# EAGLE design Board (EAGLE 8.5.2)
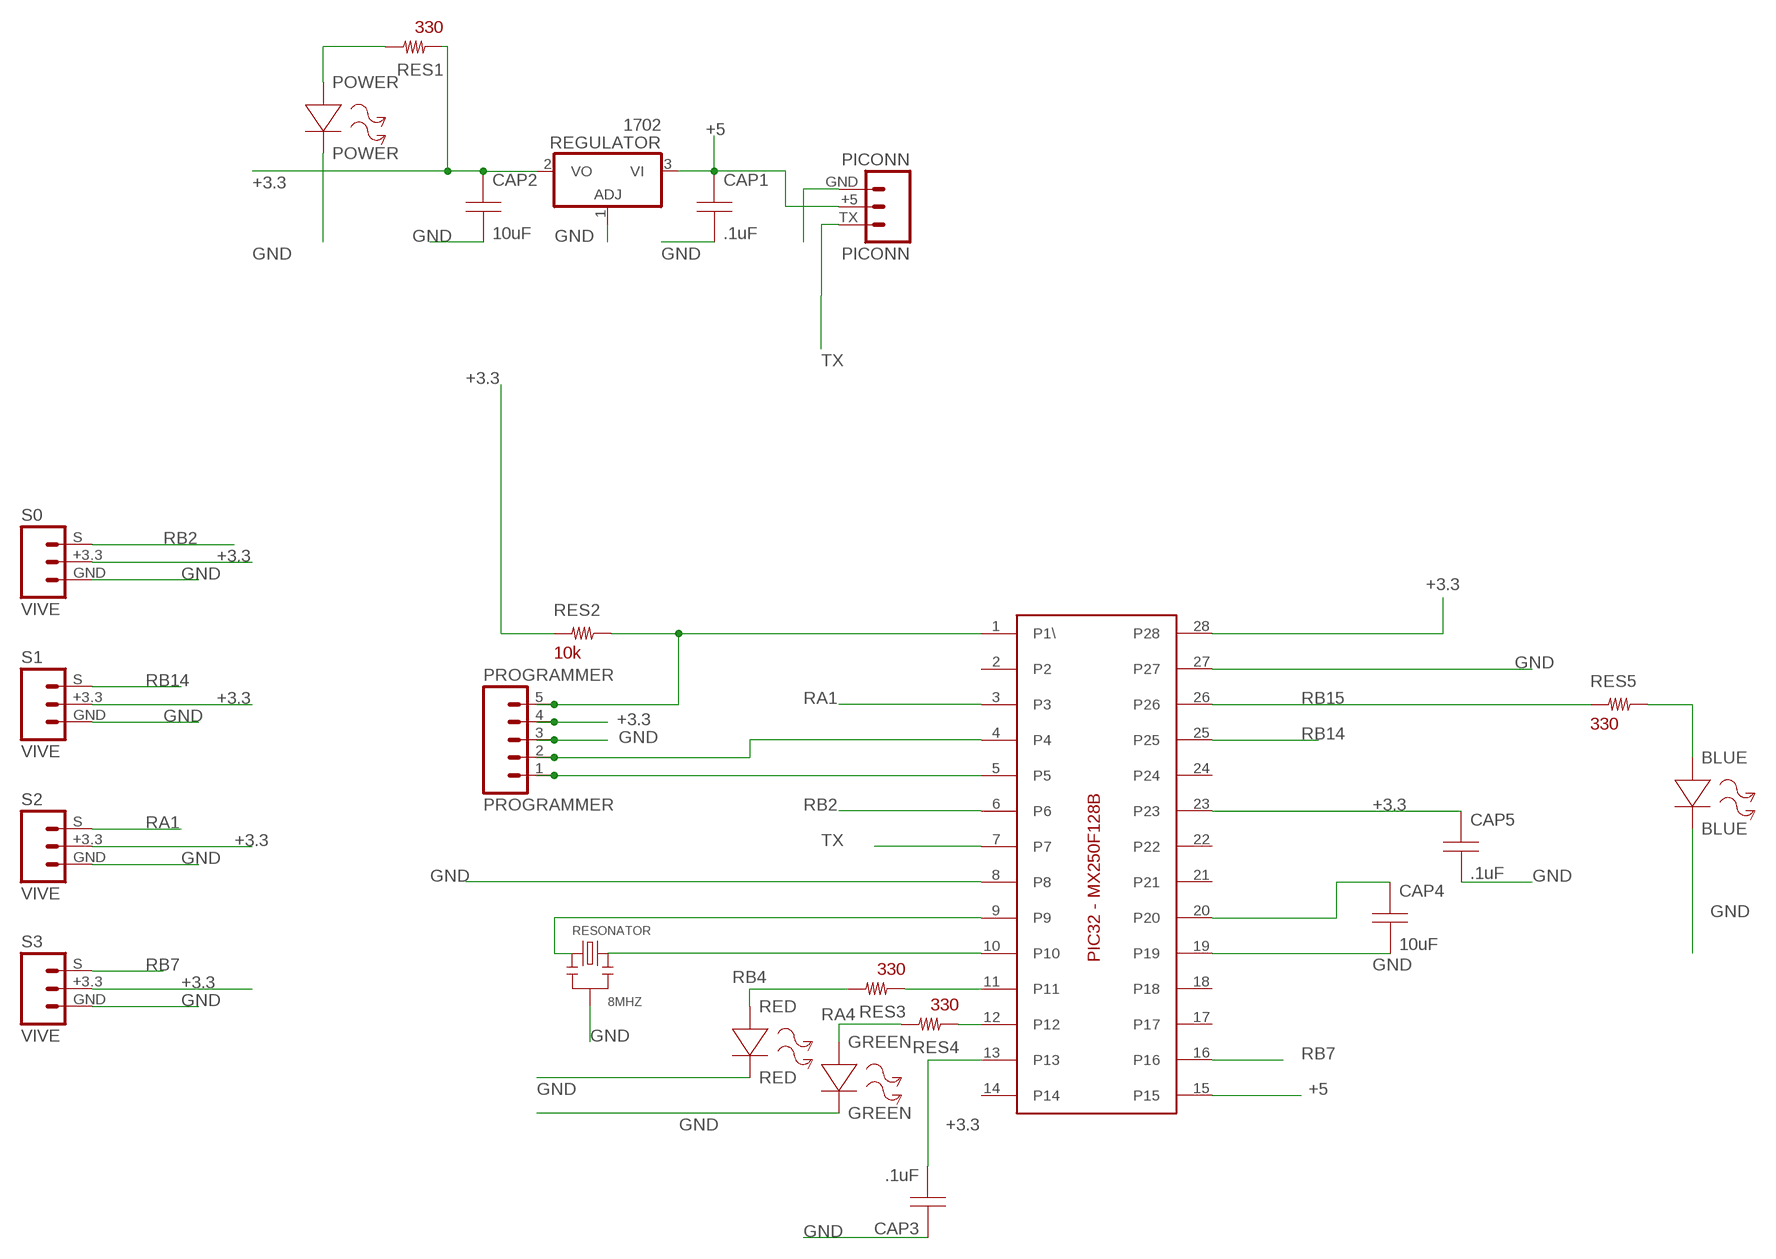
[diagram p0: schematic, sheet 1]

## Parts
1702  REGULATOR  [REGULATOR3P]
BLUE  BLUE  LEDL0603  [L0603]
CAP1  .1uF  CAPACITOR0603  [C0603]
CAP2  10uF  CAPACITOR0805  [C0805]
CAP3  .1uF  CAPACITOR0603  [C0603]
CAP4  10uF  CAPACITOR0805  [C0805]
CAP5  .1uF  CAPACITOR0603  [C0603]
GREEN  GREEN  LEDL0603  [L0603]
PIC  PIC32-MX250F128BSSOP  [PIC32SSOP]
PICONN  PICONN  [PICONN]
POWER  POWER  LEDL0603  [L0603]
PROGRAMMER  PROGRAMMER  PROGRAMMERPTH  [PROGRAMMER5P]
RED  RED  LEDL0603  [L0603]
RES1  330  RESISTORR0603  [R0603]
RES2  10k  RESISTORR0603  [R0603]
RES3  330  RESISTORR0603  [R0603]
RES4  330  RESISTORR0603  [R0603]
RES5  330  RESISTORR0603  [R0603]
RESONATOR  8MHZ  OSCILATOROSC  [OSC]
S0  VIVE  [VIVE]
S1  VIVE  [VIVE]
S2  VIVE  [VIVE]
S3  VIVE  [VIVE]

## Nets
+3.3: 1702.2(VO) CAP2.1(A) CAP3.2(B) CAP5.1(A) PIC.13 PIC.23 PIC.28 PROGRAMMER.4 RES1.1 RES2.1 S0.+3.3 S1.+3.3 S2.+3.3 S3.+3.3
+5: 1702.3(VI) CAP1.1(A) PIC.15 PICONN.+5
GND: 1702.1(ADJ) BLUE.2(-) CAP1.2(B) CAP2.2(B) CAP3.1(A) CAP4.2(B) CAP5.2(B) GREEN.2(-) PIC.8 PIC.19 PIC.27 PICONN.GND POWER.2(-) PROGRAMMER.3 RED.2(-) RESONATOR.2 S0.GND S1.GND S2.GND S3.GND
N$1: PIC.10 RESONATOR.3
N$2: PIC.9 RESONATOR.1
N$3: POWER.1(+) RES1.2
N$4: PIC.4 PROGRAMMER.2
N$5: CAP4.1(A) PIC.20
N$6: PIC.12 RES4.1
N$7: PIC.1(P1\) PROGRAMMER.5 RES2.2
N$8: PIC.11 RES3.1
N$9: PIC.5 PROGRAMMER.1
N$11: BLUE.1(+) RES5.2
RA1: PIC.3 S2.S
RA4: GREEN.1(+) RES4.2
RB2: PIC.6 S0.S
RB4: RED.1(+) RES3.2
RB7: PIC.16 S3.S
RB14: PIC.25 S1.S
RB15: PIC.26 RES5.1
TX: PIC.7 PICONN.TX
Unconnected: PIC.2 PIC.14 PIC.17 PIC.18 PIC.21 PIC.22 PIC.24

## Library data of the parts
1702 = 433:REGULATOR: Positive VOLTAGE REGULATOR
BLUE GREEN POWER RED = 433:LED
CAP1-CAP5 = 433:CAPACITOR
PIC = 433:PIC32-MX250F128B
PICONN = 433:PICONN
PROGRAMMER = 433:PROGRAMMER: Header 5 Standard 5-pin 0.1" header. Use with straight break away headers (SKU : PRT-00116), right angle break away headers (PRT-00553), swiss pins (PRT-00743), machine pins (PRT-00117), and female headers (PRT-00115). Molex polarized connector foot print use with SKU : PRT-08230 with associated crimp pins and housings.
RES1-RES5 = 433:RESISTOR
RESONATOR = 433:OSCILATOR: 306030010
S0 S1-S3 = 433:VIVE

## Board
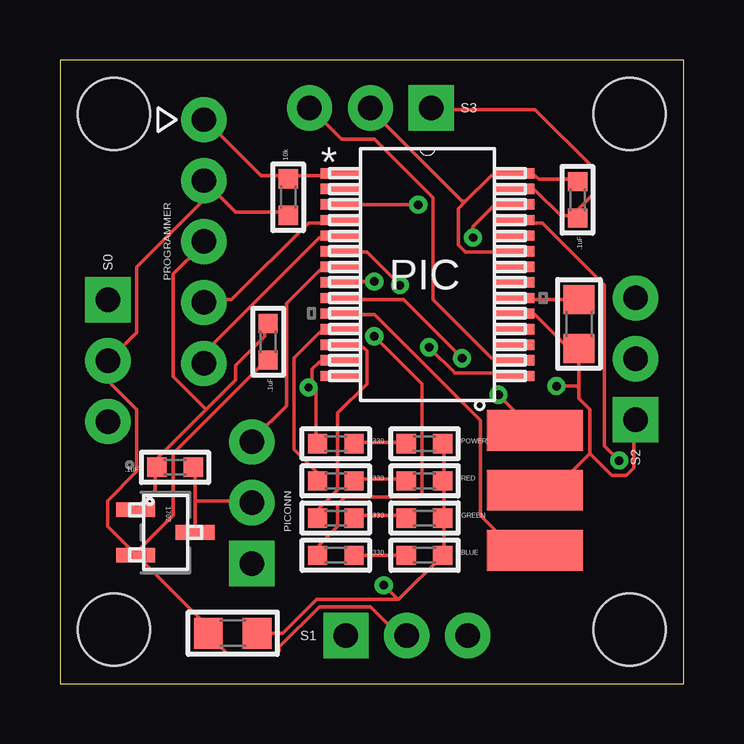
[diagram p1: board, top side]
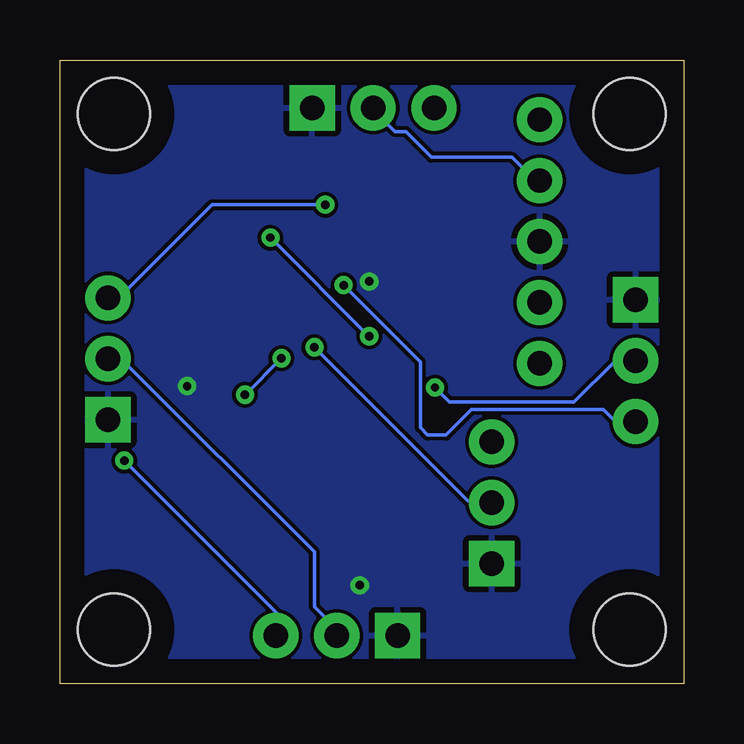
[diagram p2: board, bottom side, seen from below]

Size 26 x 26 mm. Coordinates in mm from the lower left corner, seen from the top.
Outline: 0,0 26,0 26,26 0,26 0,0
Copper layers (1*16): Top 0.035mm / dielectric 1.5mm / Bottom 0.035mm
Design rules "default": minimum track width 6mil, minimum drill 0.35mm, track to track 6mil, track to pad 6mil, pad to pad 6mil, via to via 6mil, smd to smd 6mil, copper to edge 40mil, drill to drill 6mil, minimum pad ring 10mil, minimum via ring 8mil, stop-mask expansion 4mil, vias tented up to drill 0mil, thermal gap 10mil
Holes 3 mm at 2.25,23.75 23.75,23.75 23.75,2.25 2.25,2.25

### Footprints (pad centres in the part's own frame; a part is rotated, then mirrored left to right if it is on the bottom)
REGULATOR3P = smd 0.61 x 1.626: 1 -0.95,-1.245; 2 0.95,-1.245; 3 0,1.245
L0603 = smd 0.8 x 0.8: 1 -0.762,0; 2 0.762,0
C0603 = smd 0.8 x 0.8: 1 -0.762,0; 2 0.762,0
C0805 = smd 1.2 x 1.3: 1 -1.016,0; 2 1.016,0
PIC32SSOP = smd 1.676 x 0.432: 1 -3.617,4.225; 2 -3.617,3.575; 3 -3.617,2.925; 4 -3.617,2.275; 5 -3.617,1.625; 6 -3.617,0.975; 7 -3.617,0.325; 8 -3.617,-0.325; 9 -3.617,-0.975; 10 -3.617,-1.625; 11 -3.617,-2.275; 12 -3.617,-2.925; 13 -3.617,-3.575; 14 -3.617,-4.225; 15 3.617,-4.225; 16 3.617,-3.575; 17 3.617,-2.925; 18 3.617,-2.275; 19 3.617,-1.625; 20 3.617,-0.975; 21 3.617,-0.325; 22 3.617,0.325; 23 3.617,0.975; 24 3.617,1.625; 25 3.617,2.275; 26 3.617,2.925; 27 3.617,3.575; 28 3.617,4.225
PICONN = drill 1.016 pad 1.88: +5 2.54,0; TX 5.08,0 | drill 1.016 pad 1.88 square: GND 0,0
PROGRAMMER5P = drill 1.016 pad 1.88: 1 0,0; 2 2.54,0; 3 5.08,0; 4 7.62,0; 5 10.16,0
R0603 = smd 0.8 x 0.8: 1 -0.762,0; 2 0.762,0
OSC = smd 1.7 x 4: 1 -2.497,-0.499; 2 -0.012,-0.501; 3 2.499,-0.508
VIVE = drill 1.016 pad 1.88: +3.3 2.54,0; S 5.08,0 | drill 1.016 pad 1.88 square: GND 0,0

### Placement (x,y rotation side)
1702  4.4,6.3 270 top
BLUE  15.2,5.35 0 top
CAP1  4.8,9.02 180 top
CAP2  7.2,2.1 0 top
CAP3  8.68,14.25 270 top
CAP4  21.64,14.99 270 top
CAP5  21.58,20.17 270 top
GREEN  15.2,6.9 0 top
PIC  15.32,17.05 0 top
PICONN  8,5 90 top
POWER  15.2,10 0 top
PROGRAMMER  6,13.35 90 top
RED  15.2,8.45 0 top
RES1  11.5,10 0 top
RES2  9.52,20.28 90 top
RES3  11.5,8.45 0 top
RES4  11.5,6.9 0 top
RES5  11.5,5.35 0 top
RESONATOR  20.3,8.05 270 top
S0  2,16 270 top
S1  11.92,2 0 top
S2  24,11 90 top
S3  15.48,24 180 top

### Tracks (layer width: path | path; a pad name or v marks a point on that pad's centre or on a via)
+3.3  (via drill 0.35)
  Top 0.152: CAP5.1 21.49,21.03 19.96,21.03 19.81,21.18 19.05,21.18 PIC.28 18.9,21.18 17.98,21.18 16.92,20.12 | 16.92,20.12 16.61,19.81 16.61,18.29 16.92,17.98 18.9,17.98 PIC.23 | 16.92,20.12 16.76,20.12 12.95,23.93 S3.+3.3 | 6.4,20.57 6.1,20.88 PROGRAMMER.4 6.4,20.57 | 6.4,20.57 7.32,19.66 9.45,19.66 RES2.1 | 10.52,12.5 10.67,12.34 10.67,10.06 RES1.1 | 10.52,12.5 10.52,13.11 10.82,13.41 11.58,13.41 PIC.13 | v10.36,12.34 10.52,12.5 | 6.4,20.57 3.2,17.37 3.2,14.63 2.13,13.56 S0.+3.3 2.13,13.41 2.13,12.5 3.2,11.43 3.2,8.84 1.98,7.62 1.98,6.55 3.05,5.49 1702.2 | CAP3.2 8.53,13.41 4.72,9.6 4.72,7.01 3.2,5.49 1702.2 | 1702.2 3.2,5.33 6.1,2.44 6.1,2.13 CAP2.1 6.25,1.98 7.01,1.22 8.99,1.22 9.14,1.37 9.14,1.52 10.82,3.2 12.95,3.2 14.02,2.13 14.33,2.13 S1.+3.3
  Bottom 0.152: v10.36,12.34 9.75,11.73 4.57,11.73 2.9,13.41 2.13,13.41 S0.+3.3 | S3.+3.3 12.8,23.93 12.34,23.47 12.34,23.32 12.04,23.01 11.58,23.01 10.52,21.95 7.16,21.95 6.1,20.88 PROGRAMMER.4 | S2.+3.3 23.93,13.41 23.32,13.41 15.39,5.49 15.39,3.2 14.33,2.13 S1.+3.3
+5  (via drill 0.35)
  Top 0.152: 5.64,7.62 5.64,6.4 1702.3 | 5.64,7.62 5.64,8.99 CAP1.1 | v15.39,14.02 16.46,12.95 18.9,12.95 PIC.15 | 5.64,7.62 7.92,7.62 PICONN.+5
  Bottom 0.152: v15.39,14.02 8.99,7.62 8.08,7.62 PICONN.+5
GND  (via drill 0.35)
  Top 0.152: PIC.19 19.05,15.39 19.81,15.39 21.18,14.02 21.49,14.02 CAP4.2 21.64,13.87 21.64,12.3 | 21.64,12.3 21.64,11.89 22.1,11.43 22.1,9.6 | 22.1,9.6 20.57,8.08 19.81,8.08 RESONATOR.2 | 1702.1 3.2,7.32 3.96,8.08 3.96,8.99 CAP1.2 4.12,9.14 4.12,9.45 6.1,11.43 | 6.1,11.43 7.32,12.65 7.32,13.26 8.53,14.48 8.53,14.94 CAP3.1 | PIC.27 19.05,20.57 19.81,20.57 20.88,19.51 21.49,19.51 CAP5.2 21.64,19.51 21.64,19.81 22.25,20.42 22.25,21.49 19.81,23.93 15.54,23.93 S3.GND | POWER.2 16,9.91 16,8.53 RED.2 16,8.38 16,7.01 GREEN.2 16,6.86 16,5.49 BLUE.2 14.12,3.5 | v13.11,16.76 11.73,16.76 PIC.8 | 6.1,11.43 4.72,12.8 4.72,17.07 5.94,18.29 PROGRAMMER.3 | 22.1,9.6 23.01,8.69 23.62,8.69 23.93,8.99 23.93,10.97 S2.GND | CAP2.2 9.29,2.1 10.69,3.5 14.12,3.5 | v13.5,4.1 14.1,3.5 14.12,3.5 | v20.7,12.4 21.54,12.4 21.64,12.3
  pour Bottom: 0,26 0,0 26,0 26,26
N$1
  Top 0.152: PIC.10 11.73,15.39 13.11,15.39 17.53,10.97 17.53,7.01 18.9,5.64 19.66,5.64 RESONATOR.3
N$2  (via drill 0.35)
  Top 0.152: v16.76,13.56 14.33,16 11.73,16 PIC.9 | v18.29,12.04 19.66,10.67 RESONATOR.1
  Bottom 0.152: v18.29,12.04 v16.76,13.56
N$3
  Top 0.152: RES1.2 12.34,10.06 14.33,10.06 POWER.1
N$4
  Top 0.152: PIC.4 11.58,19.2 10.36,19.2 7.16,16 6.1,16 PROGRAMMER.2
N$5
  Top 0.152: CAP4.1 21.49,16 19.05,16 PIC.20
N$6
  Top 0.152: RES4.1 10.82,7.01 10.82,7.32 11.58,8.08 11.58,11.28 12.8,12.5 12.8,13.87 12.65,14.02 11.73,14.02 PIC.12
N$7
  Top 0.152: PIC.1 11.58,21.18 9.6,21.18 RES2.2 9.45,21.18 8.38,21.18 6.1,23.47 PROGRAMMER.5
N$8
  Top 0.152: RES3.1 10.67,8.53 10.67,8.84 9.75,9.75 9.75,13.56 10.82,14.63 11.58,14.63 PIC.11
N$9
  Top 0.152: PIC.5 11.58,18.59 10.82,18.59 6.1,13.87 6.1,13.41 PROGRAMMER.1
N$11
  Top 0.152: RES5.2 12.34,5.33 14.33,5.33 BLUE.1
RA1  (via drill 0.35)
  Top 0.152: v14.94,19.96 11.73,19.96 PIC.3
  Bottom 0.152: v14.94,19.96 19.66,19.96 23.47,16.15 23.93,16.15 S2.S
RA4
  Top 0.152: RES4.2 12.34,7.01 14.33,7.01 GREEN.1
RB2  (via drill 0.35)
  Top 0.152: v14.17,16.61 12.8,17.98 11.73,17.98 PIC.6
  Bottom 0.152: v14.17,16.61 10.97,13.41 10.97,10.67 10.67,10.36 9.91,10.36 8.84,11.43 3.35,11.43 2.9,10.97 2.13,10.97 S0.S
RB4
  Top 0.152: RES3.2 12.34,8.53 14.33,8.53 RED.1
RB7
  Top 0.152: PIC.16 18.9,13.56 17.98,13.56 15.54,16 15.54,20.27 13.11,22.71 11.73,22.71 10.52,23.93 S3.S
RB14  (via drill 0.35)
  Top 0.152: v23.32,9.3 22.71,9.91 22.71,16.61 20.12,19.2 19.05,19.2 PIC.25
  Bottom 0.152: v23.32,9.3 16.92,2.9 16.92,2.13 S1.S
RB15  (via drill 0.35)
  Top 0.152: v13.11,14.48 15.09,12.5 15.09,7.92 14.94,7.77 11.89,7.77 11.58,7.47 11.58,6.55 10.82,5.79 10.82,5.49 RES5.1 | v17.22,18.59 17.22,19.05 18.14,19.96 18.9,19.96 PIC.26
  Bottom 0.152: v17.22,18.59 v13.11,14.48
TX
  Top 0.152: PIC.7 11.58,17.37 10.97,17.37 9.45,15.85 9.45,11.58 8.08,10.21 PICONN.TX